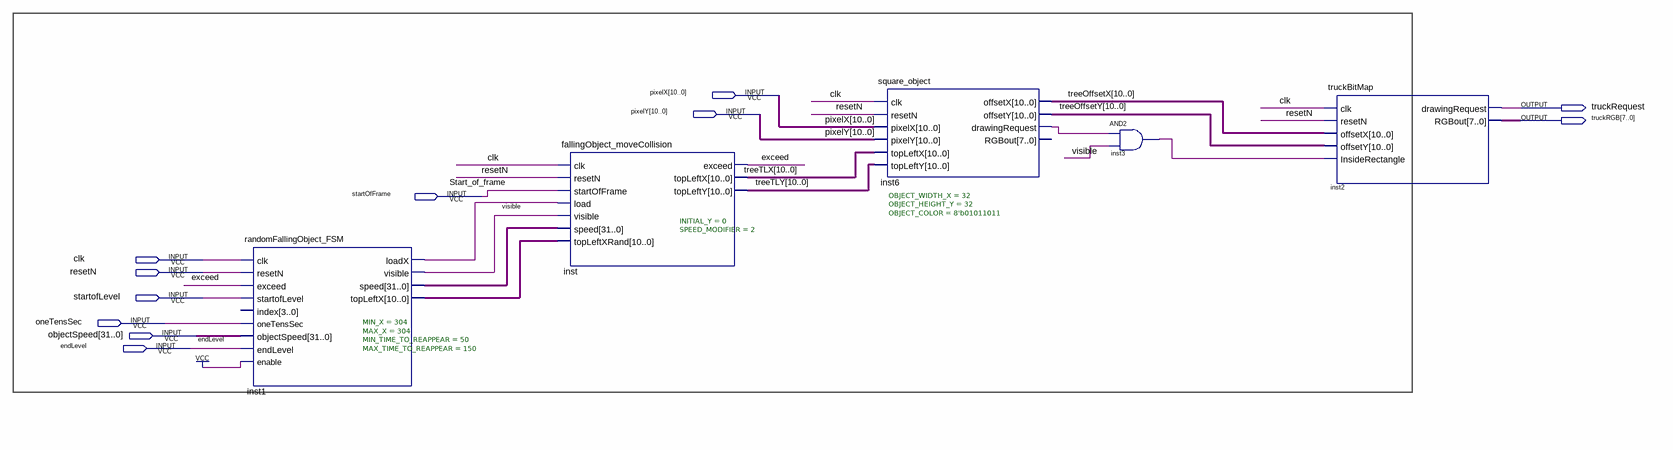
[diagram p0: schematic sheet]
// Quartus schematic TRUCK_TOP.bdf as structural Verilog: 5 symbols, 11 pins
module TRUCK_TOP (
  input  [10:0] pixelX,
  input  [10:0] pixelY,
  input  startOfFrame,
  input  clk,
  input  resetN,
  input  startofLevel,
  input  oneTensSec,
  input  [31:0] objectSpeed,
  input  endLevel,
  output truckRequest,
  output [7:0] truckRGB
);

  wire exceed, inst1_loadx, inst3_out, inst6_drawingrequest, visible;
  wire [10:0] inst1_topleftx, treeOffsetX, treeOffsetY, treeTLX, treeTLY;
  wire [31:0] inst1_speed;

  randomFallingObject_FSM #(.MIN_X(304), .MAX_X(304), .MIN_TIME_TO_REAPPEAR(50), .MAX_TIME_TO_REAPPEAR(150)) inst1 (
    .clk(clk), .resetN(resetN), .exceed(exceed), .startofLevel(startofLevel), .oneTensSec(oneTensSec),
    .objectSpeed(objectSpeed), .endLevel(endLevel), .enable(1'b1), .loadX(inst1_loadx), .visible(visible),
    .speed(inst1_speed), .topLeftX(inst1_topleftx));  // open: index
  fallingObject_moveCollision #(.INITIAL_Y(0), .SPEED_MODIFIER(2)) inst (
    .clk(clk), .resetN(resetN), .startOfFrame(startOfFrame), .load(inst1_loadx), .visible(visible),
    .speed(inst1_speed), .topLeftXRand(inst1_topleftx), .exceed(exceed), .topLeftX(treeTLX),
    .topLeftY(treeTLY));
  square_object #(.OBJECT_WIDTH_X(32), .OBJECT_HEIGHT_Y(32), .OBJECT_COLOR(8'b01011011)) inst6 (
    .clk(clk), .resetN(resetN), .pixelX(pixelX), .pixelY(pixelY), .topLeftX(treeTLX), .topLeftY(treeTLY),
    .offsetX(treeOffsetX), .offsetY(treeOffsetY), .drawingRequest(inst6_drawingrequest));  // open: RGBout
  and inst3 (inst3_out, inst6_drawingrequest, visible);
  truckBitMap inst2 (
    .clk(clk), .resetN(resetN), .offsetX(treeOffsetX), .offsetY(treeOffsetY), .InsideRectangle(inst3_out),
    .drawingRequest(truckRequest), .RGBout(truckRGB));

  // Other names for the same wires on the sheet: Start_of_frame = startOfFrame
endmodule
